# Altium project tfcard_shield.PrjPcb
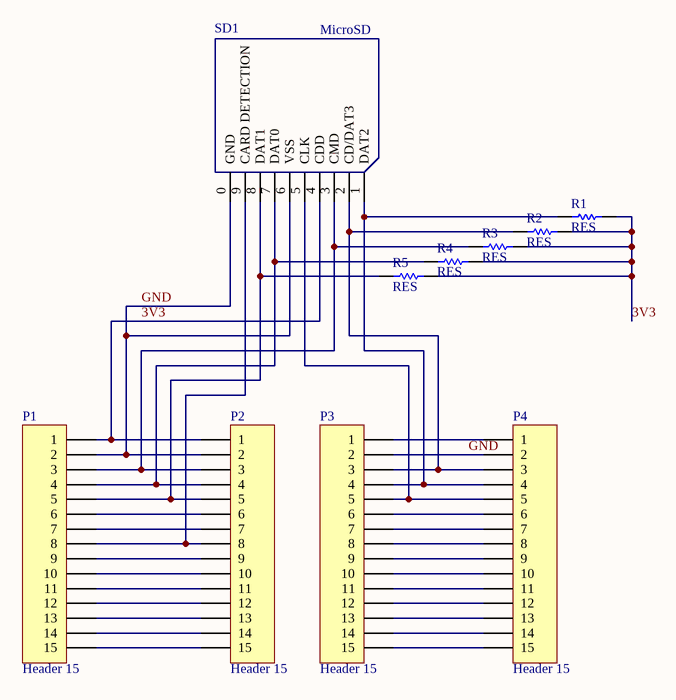
[diagram p0: tfcard_shield.SchDoc]
1 sheet, 10 parts. Net scope: global (net labels, ports and power ports of the same name join across sheets).
Board file: tfcard_shield.PcbDoc

## Sheet tfcard_shield.SchDoc: ESP32 TF卡扩展板
size A4; Author: WC

### Parts
P1  Header 15  [HDR1X15]
P2  Header 15  [HDR1X15]
P3  Header 15  [HDR1X15]
P4  Header 15  [HDR1X15]
R1  RES  [0603R]
R2  RES  [0603R]
R3  RES  [0603R]
R4  RES  [0603R]
R5  RES  [0603R]
SD1  MicroSD  [Micro SD]

### Nets
3V3: P1.1 P2.1 R1.2 R2.2 R3.2 R4.2 R5.2 SD1.4(CDD)
GND: P1.2 P2.2 P3.2 P4.2 SD1.0(GND) SD1.6(VSS)
NetP1_3: P1.3 P2.3 R3.1 SD1.3(CMD)
NetP1_4: P1.4 P2.4 R4.1 SD1.7(DAT0)
NetP1_5: P1.5 P2.5 R5.1 SD1.8(DAT1)
NetP1_6: P1.6 P2.6
NetP1_7: P1.7 P2.7
NetP1_8: P1.8 P2.8 SD1.9(CARD_DETECTION)
NetP1_9: P1.9 P2.9
NetP1_10: P1.10 P2.10
NetP1_11: P1.11 P2.11
NetP1_12: P1.12 P2.12
NetP1_13: P1.13 P2.13
NetP1_14: P1.14 P2.14
NetP1_15: P1.15 P2.15
NetP3_1: P3.1 P4.1
NetP3_3: P3.3 P4.3 R2.1 SD1.2(CD/DAT3)
NetP3_4: P3.4 P4.4 R1.1 SD1.1(DAT2)
NetP3_5: P3.5 P4.5 SD1.5(CLK)
NetP3_6: P3.6 P4.6
NetP3_7: P3.7 P4.7
NetP3_8: P3.8 P4.8
NetP3_9: P3.9 P4.9
NetP3_10: P3.10 P4.10
NetP3_11: P3.11 P4.11
NetP3_12: P3.12 P4.12
NetP3_13: P3.13 P4.13
NetP3_14: P3.14 P4.14
NetP3_15: P3.15 P4.15

### Library data of the parts
P1-P4 = Header 15: Header, 15-Pin; LatestRevisionDate: 17-Jul-2002; LatestRevisionNote: Re-released for DXP Platform.; Publisher: Altium Limited